# EAGLE schematic shared_pcb (EAGLE 7.5.0)
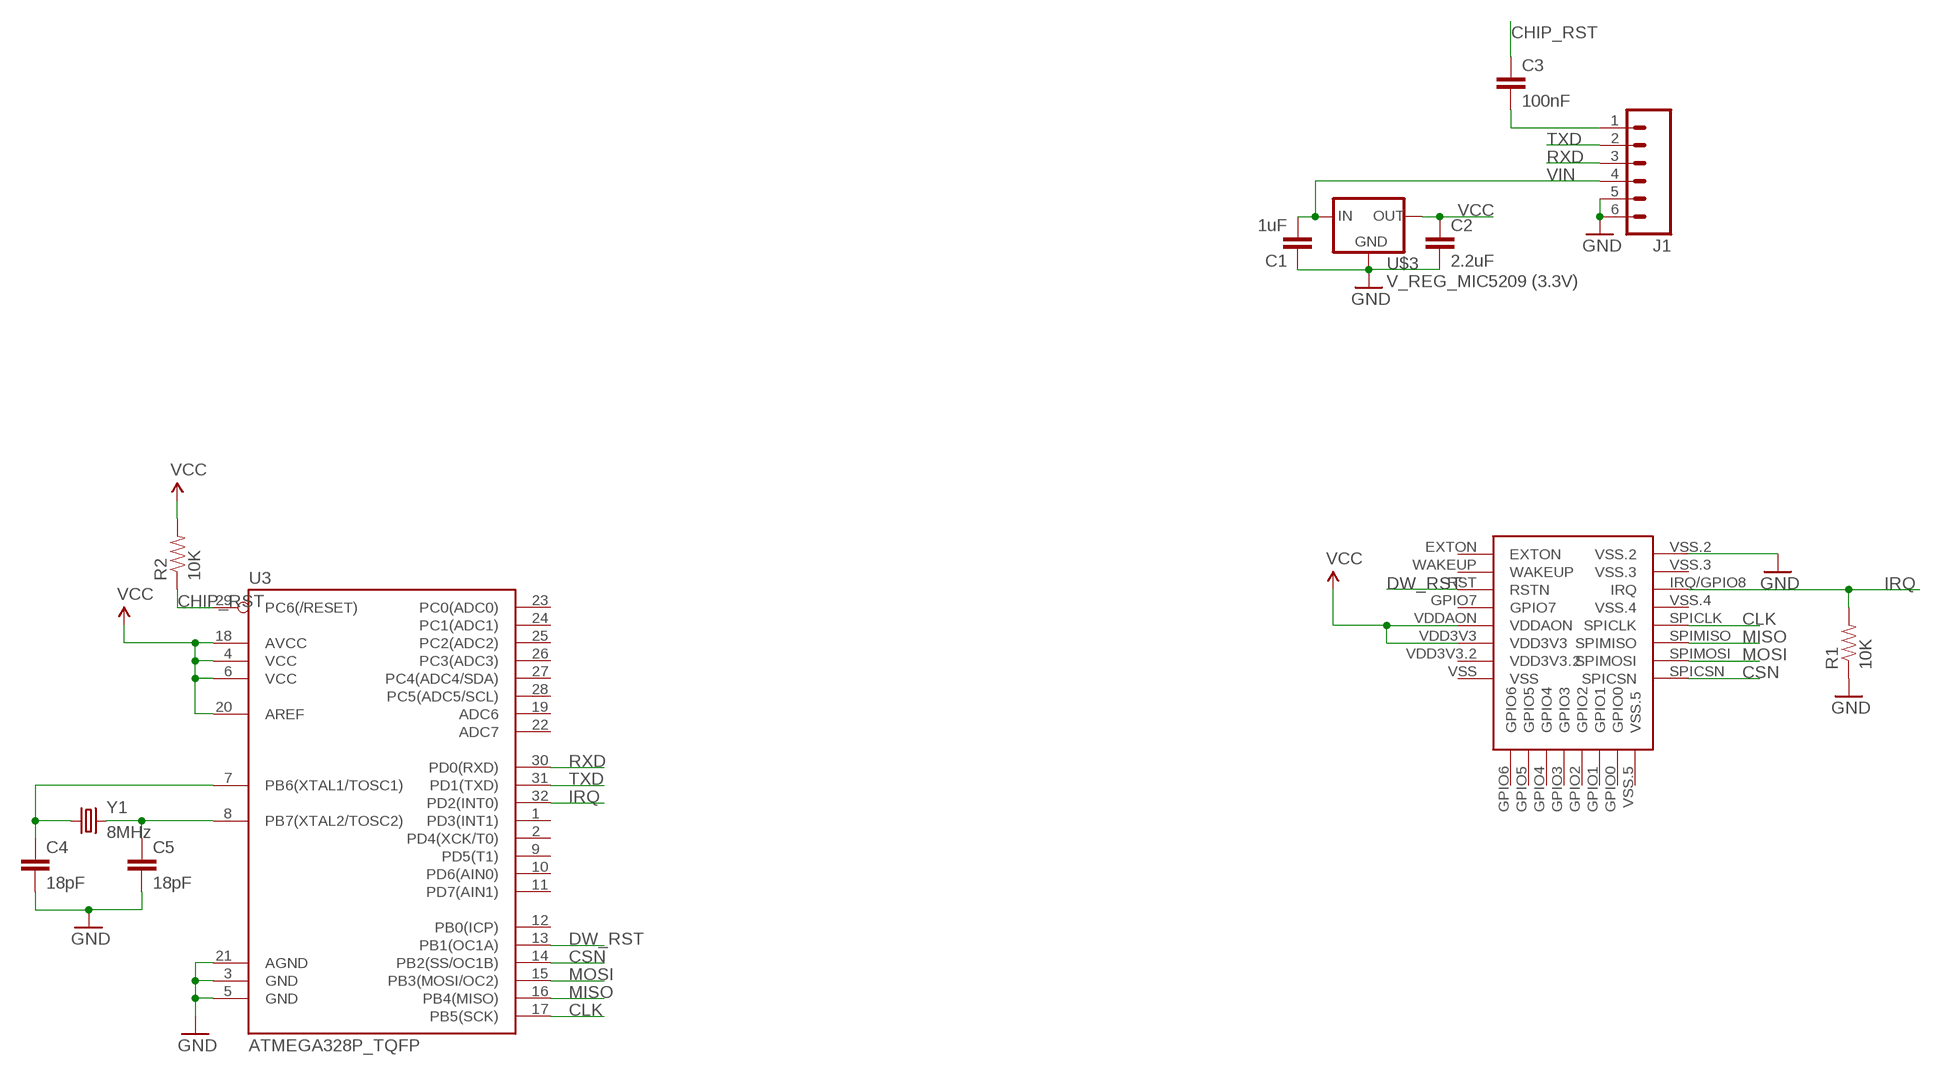
[diagram p0: schematic, sheet 1]

## Parts
C1  1uF  CAP1206  [1206]
C2  2.2uF  CAP1206  [1206]
C3  100nF  CAP1206  [1206]
C4  18pF  CAP1206  [1206]
C5  18pF  CAP1206  [1206]
J1  M06LOCK  [1X06_LOCK]
R1  10K  RESISTOR1206  [1206]
R2  10K  RESISTOR1206  [1206]
U3  ATMEGA328P_TQFP  [TQFP32-08]
U$1  DWM1000  [DWM1000]
U$3  V_REG_MIC5209 (3.3V)  V_REG_MIC2920  [SOT223]
Y1  8MHz  CRYSTALTXC-7A  [CRYSTAL-TXC-7A]

## Nets
CHIP_RST: C3.1 R2.1 U3.29(PC6(/RESET))
CLK: U3.17(PB5(SCK)) U$1.SPICLK
CSN: U3.14(PB2(SS/OC1B)) U$1.SPICSN
DW_RST: U3.13(PB1(OC1A)) U$1.RST(RSTN)
GND: C1.1 C2.2 C4.2 C5.2 J1.5 J1.6 R1.1 U3.3(GND) U3.5(GND) U3.21(AGND) U$1.VSS.2 U$3.2(GND)
IRQ: R1.2 U3.32(PD2(INT0)) U$1.IRQ/GPIO8(IRQ)
MISO: U3.16(PB4(MISO)) U$1.SPIMISO
MOSI: U3.15(PB3(MOSI/OC2)) U$1.SPIMOSI
N$3: C3.2 J1.1
N$6: C4.1 U3.7(PB6(XTAL1/TOSC1)) Y1.P$1
N$7: C5.1 U3.8(PB7(XTAL2/TOSC2)) Y1.P$2
RXD: J1.3 U3.30(PD0(RXD))
TXD: J1.2 U3.31(PD1(TXD))
VCC: C2.1 R2.2 U3.4(VCC) U3.6(VCC) U3.18(AVCC) U3.20(AREF) U$1.VDD3V3 U$1.VDDAON U$3.3(OUT)
VIN: C1.2 J1.4 U$3.1(IN)
Unconnected: U3.1(PD3(INT1)) U3.2(PD4(XCK/T0)) U3.9(PD5(T1)) U3.10(PD6(AIN0)) U3.11(PD7(AIN1)) U3.12(PB0(ICP)) U3.19(ADC6) U3.22(ADC7) U3.23(PC0(ADC0)) U3.24(PC1(ADC1)) U3.25(PC2(ADC2)) U3.26(PC3(ADC3)) U3.27(PC4(ADC4/SDA)) U3.28(PC5(ADC5/SCL)) U$1.EXTON U$1.GPIO0 U$1.GPIO1 U$1.GPIO2 U$1.GPIO3 U$1.GPIO4 U$1.GPIO5 U$1.GPIO6 U$1.GPIO7 U$1.VDD3V3.2 U$1.VSS U$1.VSS.3 U$1.VSS.4 U$1.VSS.5 U$1.WAKEUP

## Library data of the parts
C1-C5 = SparkFun-Capacitors:CAP: Capacitor Standard 0603 ceramic capacitor, and 0.1" leaded capacitor.
J1 = SparkFun-Connectors:M06: Header 6 Standard 6-pin 0.1" header. Use with straight break away headers (SKU : PRT-00116), right angle break away headers (PRT-00553), swiss pins (PRT-00743), machine pins (PRT-00117), and female headers (PRT-00115). Molex polarized connector foot print use with SKU : PRT-08094 with associated crimp pins and housings. NOTES ON THE VARIANTS LOCK and LOCK_LONGPADS... This footprint was designed to help hold the alignment of a through-hole component (i.e. 6-pin header) while soldering it into place. You may notice that each hole has been shifted either up or down by 0.005 of an inch from it's more standard position (which is a perfectly straight line). This slight alteration caused the pins (the squares in the middle) to touch the edges of the holes. Because they are alternating, it causes a "brace" to hold the component in place. 0.005 has proven to be the perfect amount of "off-center" position when using our standard breakaway headers. Although looks a little odd when you look at the bare footprint, once you have a header in there, the alteration is very hard to notice. Also,if you push a header all the way into place, it is covered up entirely on the bottom side. This idea of altering the position of holes to aid alignment will be further integrated into the Sparkfun Library for other footprints. It can help hold any component with 3 or more connection pins.
R1 R2 = SparkFun-Passives:RESISTOR: Resistor Basic schematic elements and footprints for 0603, 1206, and PTH resistors.
U3 = SparkFun-DigitalIC:ATMEGA328P_TQFP; PROD_ID: IC-09069
U$1 = DWM1000:DWM1000
U$3 = SparkFun-PowerIC:V_REG_MIC2920: MIC2920A (http://www.micrel.com/_PDF/mic2920.pdf) - 400mA output LDO Regulator
Y1 = SparkFun-FreqCtrl:CRYSTAL: Various standard crystals. Proven footprints.